# EAGLE design Board_4_Buttons_WS-TASV (EAGLE 9.6.2)
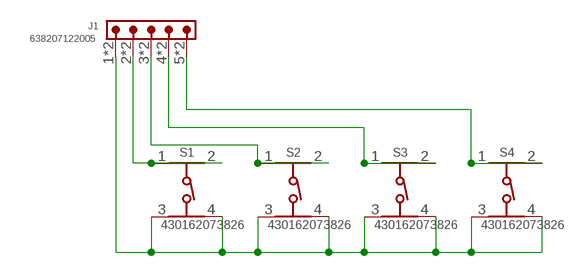
[diagram p0: schematic, sheet 1]

## Parts
J1  638207122005  638207122005  [638207122005]
S1  430162073826  [430162073826]
S2  430162073826  [430162073826]
S3  430162073826  [430162073826]
S4  430162073826  [430162073826]

## Nets
N$1: J1.1 J1.A1 S1.3 S1.4 S2.3 S2.4 S3.3 S3.4 S4.3 S4.4
N$5: J1.2 J1.A2 S1.1 S1.2
N$6: J1.3 J1.A3 S2.1 S2.2
N$7: J1.4 J1.A4 S3.1 S3.2
N$8: J1.5 J1.A5 S4.1 S4.2

## Library data of the parts
J1 = Wurth_Connectors_WR-FAST:638207122005: WR-FAST 5.08 mm THT Male Header Angled Blade 2863 KIND PROPERTIES Pitch 5.08 mm Gender Male MATERIAL PROPERTIES Insulator Material PC Insulator Flammability Rating UL94 V-0 Insulator Color Black Contact Material Steel Contact Plating Tin Contact Type Stamped GENERAL INFORMATION Operating Temperature -30 up to +120 °C Working Voltage 300 V (AC) Withstanding Voltage 1600 V (AC) Contact Resistance 20 mΩ RISO 5 MΩ IR 16 A CERTIFICATION cULus Approval E150931 PACKAGING PROPERTIES Packaging Box <https://www.we-online.com/catalog/media/o166976v209%20Family_WR-FAST_638207122003.jpg> Details see: https://www.we-online.com/catalog/en/FAST_5_08_THT_MALE_ANGLED_6382071220XX/ Updated by Ella Wu 2020-08-11 2020(C) Wurth Elektronik; CONTACT-RESISTANCE: 20mOhm; DATASHEET-URL: https://www.we-online.com/catalog/datasheet/638207122005.pdf; GENDER: Male; IR: 16A; MOUNT: THT; PART-NUMBER: 638207122005; PINS: 5; PITCH: 5.08mm; TYPE: Right Angled; WORKING-VOLTAGE: 300V(AC)
S1-S4 = Wurth_Switch_WS-TASV:430162073826: WS-TASV SMT Tact Switch 12x12 mm Material Properties Cover Material : Stainless Steel Properties Actuator Material LCP Actuator Flammability Rating UL94 V-0 Actuator Color Black; White Frame Material PPA Frame Flammability Rating UL94 V-0 Frame Color Black Contact Material Stainless Steel Contact Plating Silver Terminal Material Copper Alloy Terminal Plating Silver VR 12 V (DC) Contact Resistance Initial 100 mΩ Contact Resistance After Life Test 2 Ω RISO 100 MΩ Withstanding Voltage 250 V (AC) Washable No Qty. 250; 400 Mechanical Properties Electrical Life:300000 Times; 500000 Times Stroke :0.3 mm General Information Operating Temperature:-40 up to +85 °C Washable:No Packaging Properties Packaging:Tape and Reel <https://www.we-online.com/catalog/media/o76676v209%20Family_WS-TASV-Gruppe.jpg> Details see: https://www.we-online.com/catalog/en/TASV_12X12_SMD/ Updated by yingchun,Shan;2020-02-20 2020(C) Würth Elektronik; DATASHEET-URL: https://www.we-online.com/redexpert/spec/430162073826?ae; HEIGHT: 7.3mm; OPERATION-FORCE: 260g; PART-NUMBER: 430162073826; QTY: 250

## Board
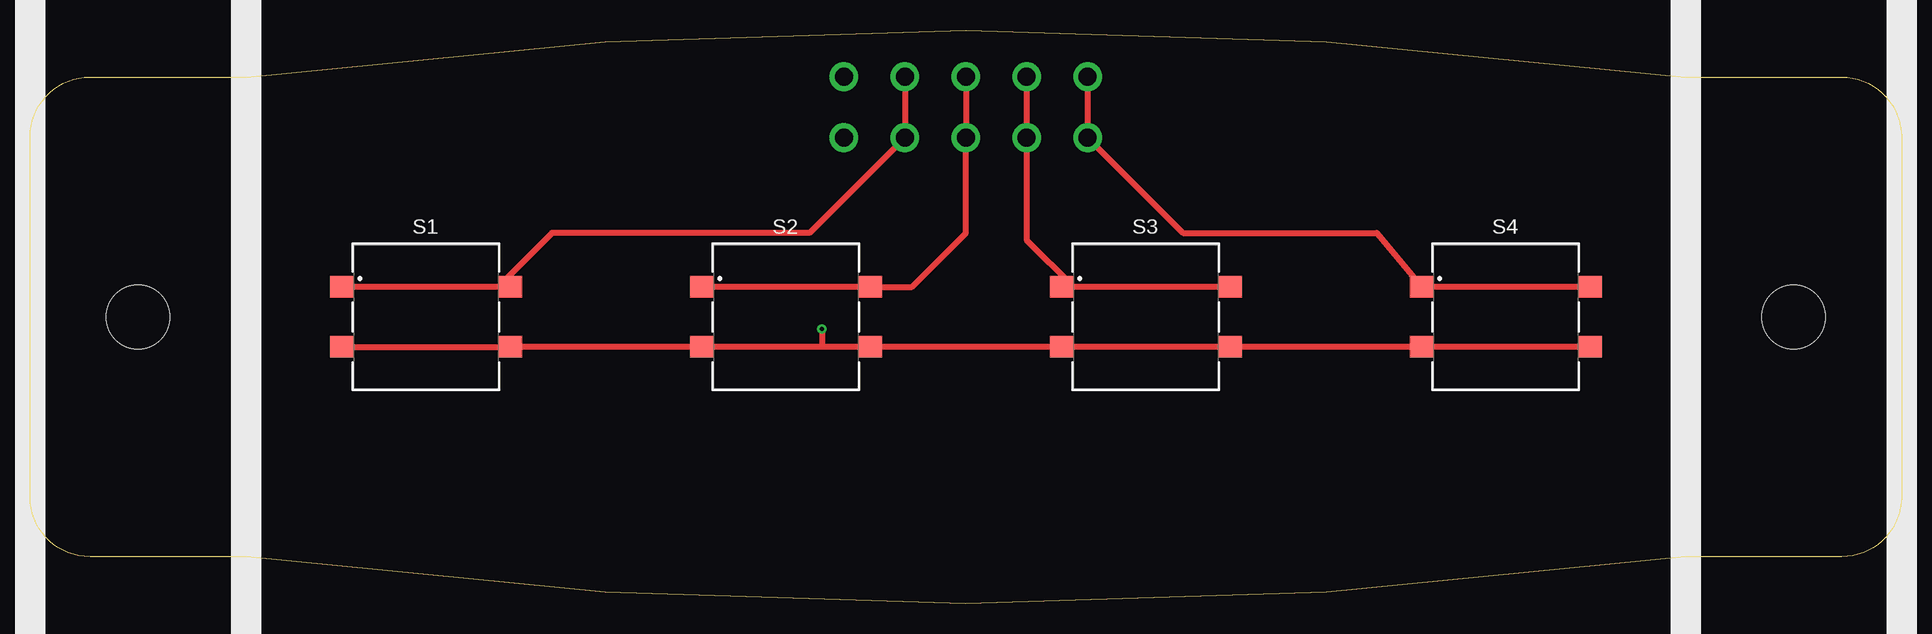
[diagram p1: board, top side]
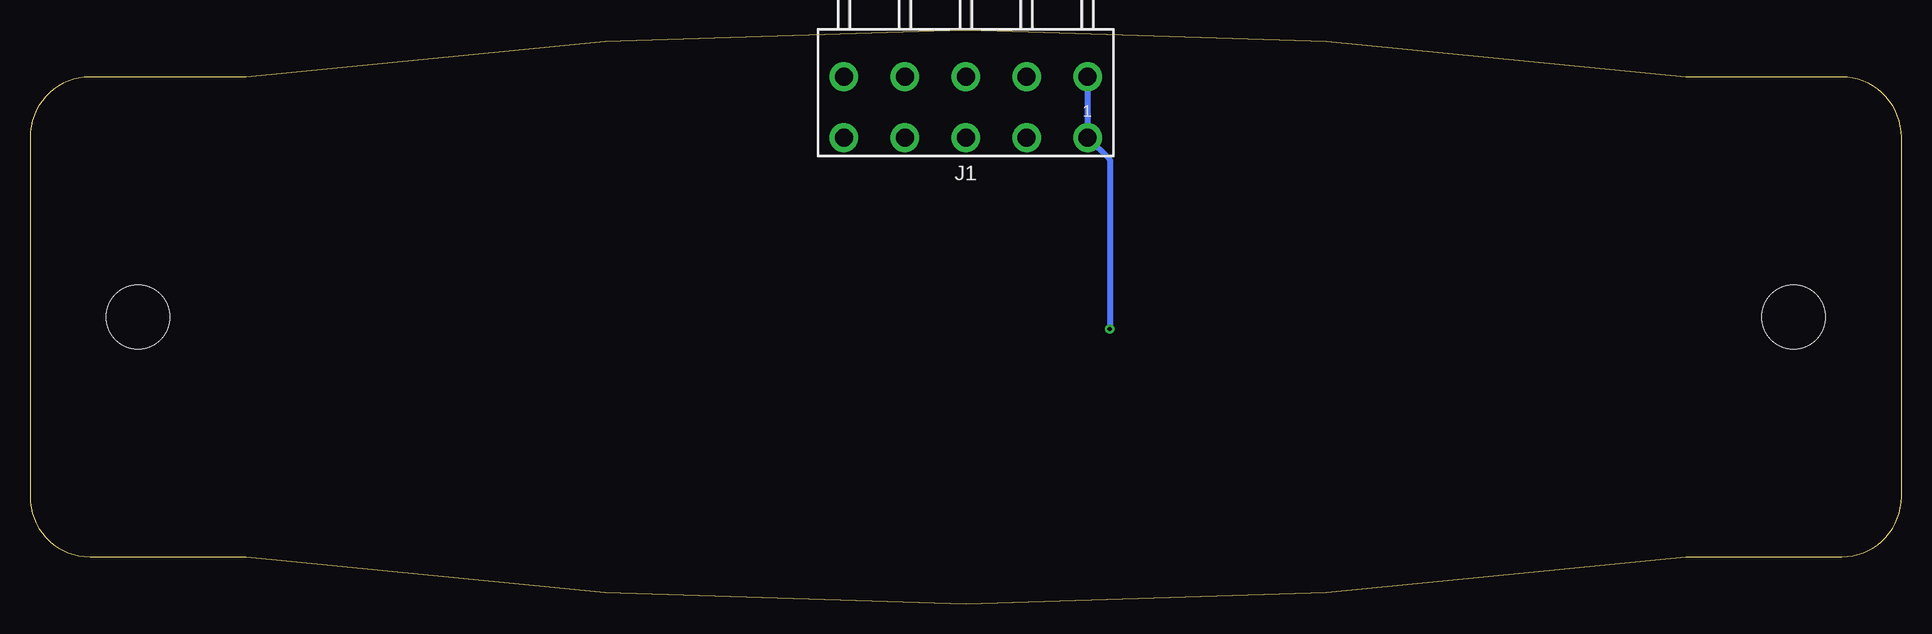
[diagram p2: board, bottom side, seen from below]

Size 156 x 47.87 mm. Coordinates in mm from the lower left corner, seen from the top.
Outline: 18,3.93 5,3.93 arc-90 0,8.93 0,38.93 arc-90 5,43.93 18,43.93 arc-15 138,43.93 151,43.93 arc-90 156,38.93 156,8.93 arc-90 151,3.93 138,3.93 arc-15 18,3.93
Copper layers (1*16): Top 0.035mm / dielectric 1.5mm / Bottom 0.035mm
Design rules "default *": minimum track width 6mil, minimum drill 0.35mm, track to track 6mil, track to pad 6mil, pad to pad 6mil, via to via 6mil, smd to smd 6mil, copper to edge 40mil, drill to drill 6mil, minimum pad ring 0.45mm, minimum via ring 8mil, stop-mask expansion 4mil, vias tented up to drill 4mm, thermal gap 10mil
Holes 5.3 mm at 9,23.93 147,23.93

### Footprints (pad centres in the part's own frame; a part is rotated, then mirrored left to right if it is on the bottom)
638207122005 = drill 1.5: 1 -10.16,2.54; 2 -5.08,2.54; 3 0,2.54; 4 5.08,2.54; 5 10.16,2.54; A1 -10.16,-2.54; A2 -5.08,-2.54; A3 0,-2.54; A4 5.08,-2.54; A5 10.16,-2.54
430162073826 = smd 2 x 1.8: 1 -7,2.5; 2 7,2.5; 3 -7,-2.5; 4 7,-2.5

### Placement (x,y rotation side)
J1  78,41.43 180 bottom
S1  33,23.93 0 top
S2  63,23.93 0 top
S3  93,23.93 0 top
S4  123,23.93 0 top

### Tracks (layer width: path | path; a pad name or v marks a point on that pad's centre or on a via)
N$1  (via drill 0.35)
  Top 0.508: S1.3 S1.4 S2.3 66,21.43 | 66,21.43 S2.4 S3.3 S3.4 S4.3 S4.4 | v66,22.93 66,21.43
  Bottom 0.508: J1.A1 J1.1 66,37.05 v66,22.93
N$5
  Top 0.508: S1.2 39,26.43 | 39,26.43 S1.1 | 39,26.43 43.5,30.93 64.96,30.93 J1.2 J1.A2
N$6
  Top 0.508: S2.1 S2.2 73.5,26.43 78,30.93 J1.3 J1.A3
N$7
  Top 0.508: S3.2 87,26.43 | 87,26.43 S3.1 | 87,26.43 83.08,30.35 J1.4 J1.A4
N$8
  Top 0.508: S4.2 S4.1 112.25,30.93 96.12,30.93 J1.5 J1.A5